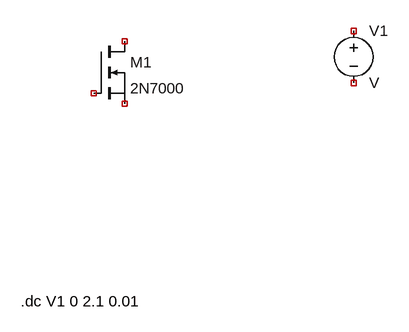
[diagram p0: schematic 2.asc]
2.asc, the LTspice schematic file:
Version 4
SHEET 1 880 680
SYMBOL nmos 144 160 R0
SYMATTR InstName M1
SYMATTR Value 2N7000
SYMBOL voltage 544 128 R0
SYMATTR InstName V1
TEXT 32 560 Left 2 !.dc V1 0 2.1 0.01

The netlist it stands for:
* 2.asc
M1 NC_01 NC_02 NC_03 NC_03 2N7000
V1 NC_04 NC_05 V
.model NMOS NMOS
.model PMOS PMOS
.lib standard.mos
.dc V1 0 2.1 0.01
.backanno
.end